# EAGLE schematic stm32f103c8t6board (EAGLE 9.6.1)
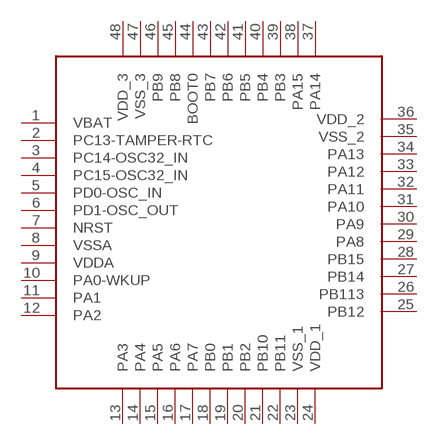
[diagram p0: schematic, sheet 1]

## Parts
STM32F103C8T6  STM32F103C8T6  [QFP50P900X900X160-48N]
Unconnected: STM32F103C8T6.1(VBAT) STM32F103C8T6.2(PC13-TAMPER-RTC) STM32F103C8T6.3(PC14-OSC32_IN) STM32F103C8T6.4(PC15-OSC32_IN) STM32F103C8T6.5(PD0-OSC_IN) STM32F103C8T6.6(PD1-OSC_OUT) STM32F103C8T6.7(NRST) STM32F103C8T6.8(VSSA) STM32F103C8T6.9(VDDA) STM32F103C8T6.10(PA0-WKUP) STM32F103C8T6.11(PA1) STM32F103C8T6.12(PA2) STM32F103C8T6.13(PA3) STM32F103C8T6.14(PA4) STM32F103C8T6.15(PA5) STM32F103C8T6.16(PA6) STM32F103C8T6.17(PA7) STM32F103C8T6.18(PB0) STM32F103C8T6.19(PB1) STM32F103C8T6.20(PB2) STM32F103C8T6.21(PB10) STM32F103C8T6.22(PB11) STM32F103C8T6.23(VSS_1) STM32F103C8T6.24(VDD_1) STM32F103C8T6.25(PB12) STM32F103C8T6.26(PB113) STM32F103C8T6.27(PB14) STM32F103C8T6.28(PB15) STM32F103C8T6.29(PA8) STM32F103C8T6.30(PA9) STM32F103C8T6.31(PA10) STM32F103C8T6.32(PA11) STM32F103C8T6.33(PA12) STM32F103C8T6.34(PA13) STM32F103C8T6.35(VSS_2) STM32F103C8T6.36(VDD_2) STM32F103C8T6.37(PA14) STM32F103C8T6.38(PA15) STM32F103C8T6.39(PB3) STM32F103C8T6.40(PB4) STM32F103C8T6.41(PB5) STM32F103C8T6.42(PB6) STM32F103C8T6.43(PB7) STM32F103C8T6.44(BOOT0) STM32F103C8T6.45(PB8) STM32F103C8T6.46(PB9) STM32F103C8T6.47(VSS_3) STM32F103C8T6.48(VDD_3)

## Library data of the parts
STM32F103C8T6 = stm32F103c8t6:STM32F103C8T6: STM32F103c8t6 micro controller